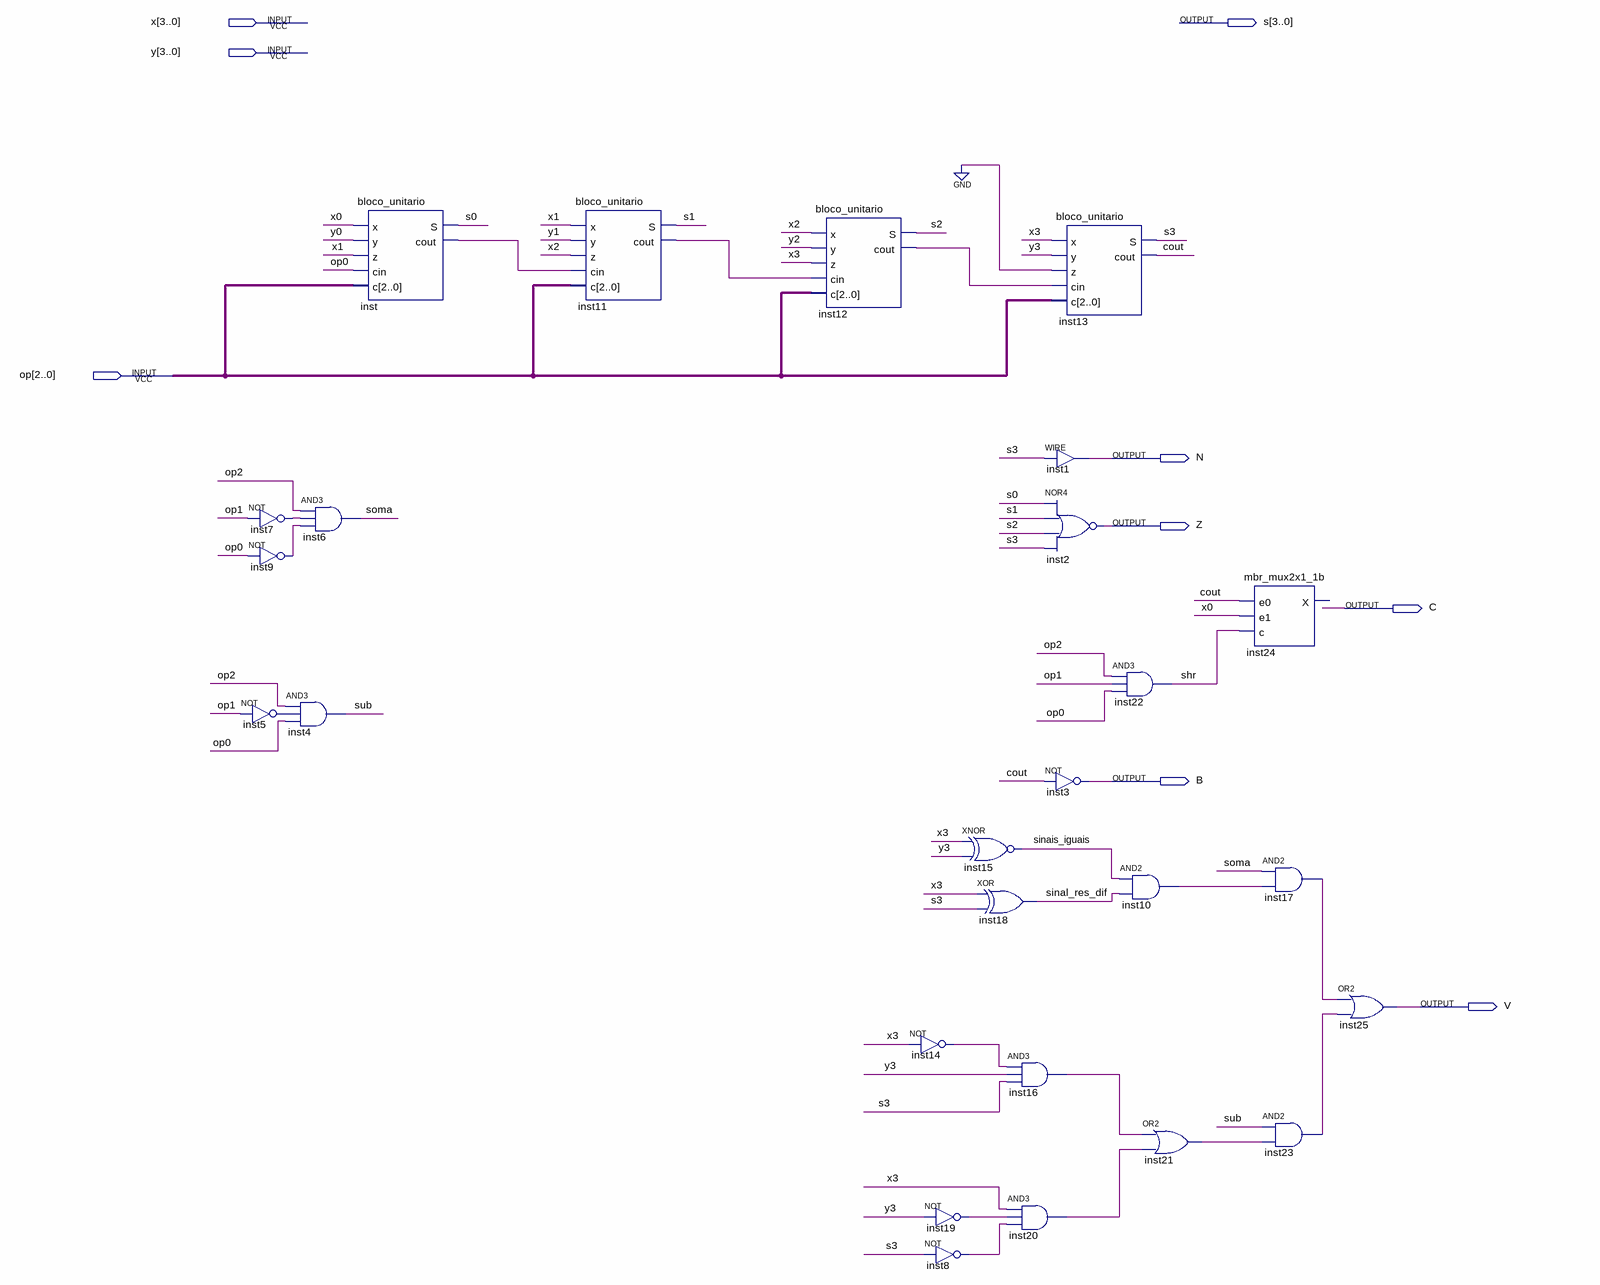
[diagram p0: schematic sheet]
// Quartus schematic mbr_ula.bdf as structural Verilog: 26 symbols, 9 pins
module mbr_ula (
  input  [3:0] x,
  input  [3:0] y,
  input  [2:0] op,
  output [3:0] s,
  output N,
  output Z,
  output C,
  output B,
  output V
);

  wire cout, inst5_out, inst7_out, inst8_out, inst9_out, inst10_out, inst11_cout, inst12_cout, inst14_out,
       inst16_out, inst17_out, inst19_out, inst20_out, inst21_out, inst23_out, inst_cout, shr, sinais_iguais,
       sinal_res_dif, soma, sub;

  not inst7 (inst7_out, op[1]);
  not inst9 (inst9_out, op[0]);
  not inst5 (inst5_out, op[1]);
  and inst6 (soma, op[2], inst7_out, inst9_out);
  and inst4 (sub, op[2], inst5_out, op[0]);
  bloco_unitario inst (.x(x[0]), .y(y[0]), .z(x[1]), .cin(op[0]), .c(op), .S(s[0]), .cout(inst_cout));
  bloco_unitario inst11 (.x(x[1]), .y(y[1]), .z(x[2]), .cin(inst_cout), .c(op), .S(s[1]), .cout(inst11_cout));
  bloco_unitario inst12 (.x(x[2]), .y(y[2]), .z(x[3]), .cin(inst11_cout), .c(op), .S(s[2]), .cout(inst12_cout));
  not inst14 (inst14_out, x[3]);
  xnor inst15 (sinais_iguais, x[3], y[3]);
  xor inst18 (sinal_res_dif, x[3], s[3]);
  not inst19 (inst19_out, y[3]);
  not inst8 (inst8_out, s[3]);
  and inst16 (inst16_out, inst14_out, y[3], s[3]);
  and inst20 (inst20_out, x[3], inst19_out, inst8_out);
  bloco_unitario inst13 (.x(x[3]), .y(y[3]), .z(1'b0), .cin(inst12_cout), .c(op), .S(s[3]), .cout(cout));
  assign N = s[3];  // WIRE inst1
  nor inst2 (Z, s[0], s[1], s[2], s[3]);
  not inst3 (B, cout);
  and inst22 (shr, op[2], op[1], op[0]);
  and inst10 (inst10_out, sinais_iguais, sinal_res_dif);
  or inst21 (inst21_out, inst16_out, inst20_out);
  mbr_mux2x1_1b inst24 (.e0(cout), .e1(x[0]), .c(shr));  // open: X
  and inst17 (inst17_out, soma, inst10_out);
  and inst23 (inst23_out, sub, inst21_out);
  or inst25 (V, inst17_out, inst23_out);
endmodule
